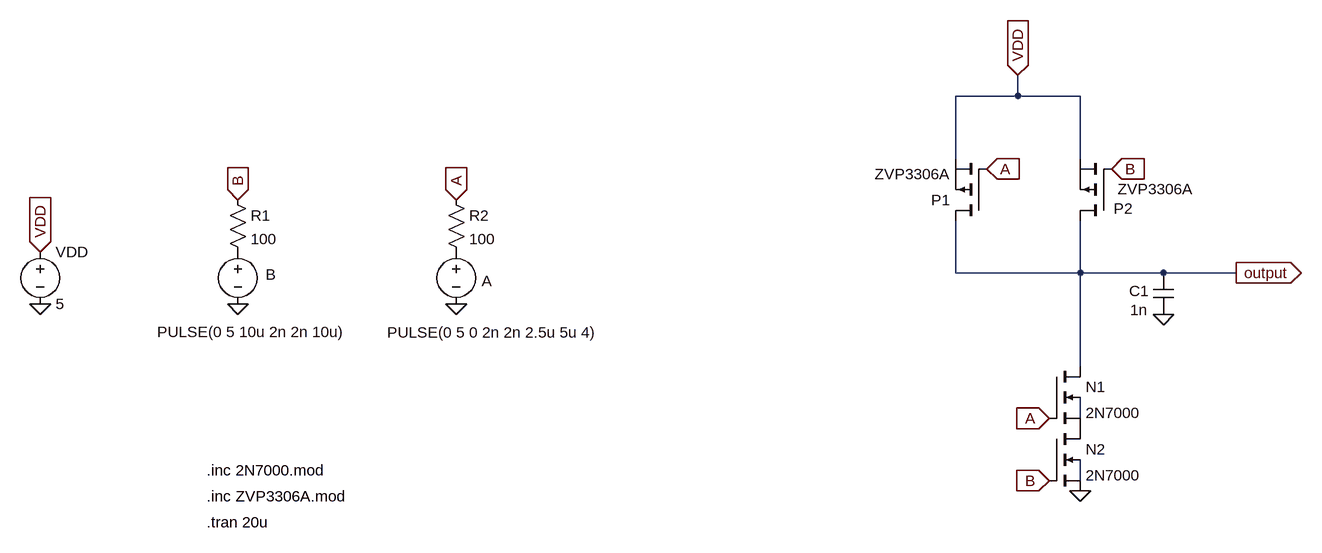
[diagram p0: schematic NAND.asc]
NAND.asc, the LTspice schematic file:
Version 4.1
SHEET 1 1872 680
WIRE 768 -208 768 -240
WIRE 768 -208 672 -208
WIRE 864 -208 768 -208
WIRE 672 -112 672 -208
WIRE 864 -112 864 -208
WIRE 672 64 672 -16
WIRE 864 64 864 -16
WIRE 864 64 672 64
WIRE 992 64 864 64
WIRE 1104 64 992 64
WIRE 864 208 864 64
WIRE 864 288 864 256
WIRE 864 384 864 352
FLAG 864 400 0
FLAG -96 -48 A
IOPIN -96 -48 In
FLAG -96 112 0
FLAG -432 -48 B
IOPIN -432 -48 In
FLAG -432 112 0
FLAG -736 32 VDD
IOPIN -736 32 In
FLAG -736 112 0
FLAG 768 -240 VDD
IOPIN 768 -240 In
FLAG 1104 64 output
IOPIN 1104 64 Out
FLAG 720 -96 A
IOPIN 720 -96 In
FLAG 816 288 A
IOPIN 816 288 In
FLAG 912 -96 B
IOPIN 912 -96 In
FLAG 816 384 B
IOPIN 816 384 In
FLAG 992 128 0
SYMBOL pmos 720 -16 R180
SYMATTR InstName P1
SYMATTR Value ZVP3306A
SYMATTR Prefix X
SYMBOL nmos4 816 304 R0
SYMATTR InstName N2
SYMATTR Value 2N7000
SYMATTR Prefix X
SYMBOL pmos 912 -16 R180
WINDOW 0 -33 19 Left 2
WINDOW 3 -126 49 Left 2
SYMATTR InstName P2
SYMATTR Value ZVP3306A
SYMATTR Prefix X
SYMBOL nmos4 816 208 R0
SYMATTR InstName N1
SYMATTR Value 2N7000
SYMATTR Prefix X
SYMBOL voltage -96 16 R0
WINDOW 0 39 61 Left 2
WINDOW 3 -106 140 Left 2
WINDOW 123 0 0 Left 0
WINDOW 39 0 0 Left 0
SYMATTR InstName A
SYMATTR Value PULSE(0 5 0 2n 2n 2.5u 5u 4)
SYMBOL voltage -432 16 R0
WINDOW 0 43 51 Left 2
WINDOW 3 -124 139 Left 2
WINDOW 123 0 0 Left 0
WINDOW 39 0 0 Left 0
SYMATTR InstName B
SYMATTR Value PULSE(0 5 10u 2n 2n 10u)
SYMBOL voltage -736 16 R0
WINDOW 123 0 0 Left 0
WINDOW 39 0 0 Left 0
SYMATTR InstName VDD
SYMATTR Value 5
SYMBOL res -448 -64 R0
SYMATTR InstName R1
SYMATTR Value 100
SYMBOL res -112 -64 R0
SYMATTR InstName R2
SYMATTR Value 100
SYMBOL cap 1008 128 R180
WINDOW 0 38 36 Left 2
WINDOW 3 40 7 Left 2
SYMATTR InstName C1
SYMATTR Value 1n
TEXT -480 368 Left 2 !.inc 2N7000.mod
TEXT -480 408 Left 2 !.inc ZVP3306A.mod
TEXT -480 448 Left 2 !.tran 20u

The netlist it stands for:
* NAND.asc
X§P1 output A VDD ZVP3306A  ; pins D G S
X§N2 P001 B 0 N002 2N7000  ; pins D G S B
X§P2 output B VDD ZVP3306A  ; pins D G S
X§N1 output A P001 N001 2N7000  ; pins D G S B
V§A P002 0 PULSE(0 5 0 2n 2n 2.5u 5u 4)
V§B P003 0 PULSE(0 5 10u 2n 2n 10u)
VDD VDD 0 5
R1 B P003 100
R2 A P002 100
C1 0 output 1n
.inc 2N7000.mod
.inc ZVP3306A.mod
.tran 20u
.backanno
.end